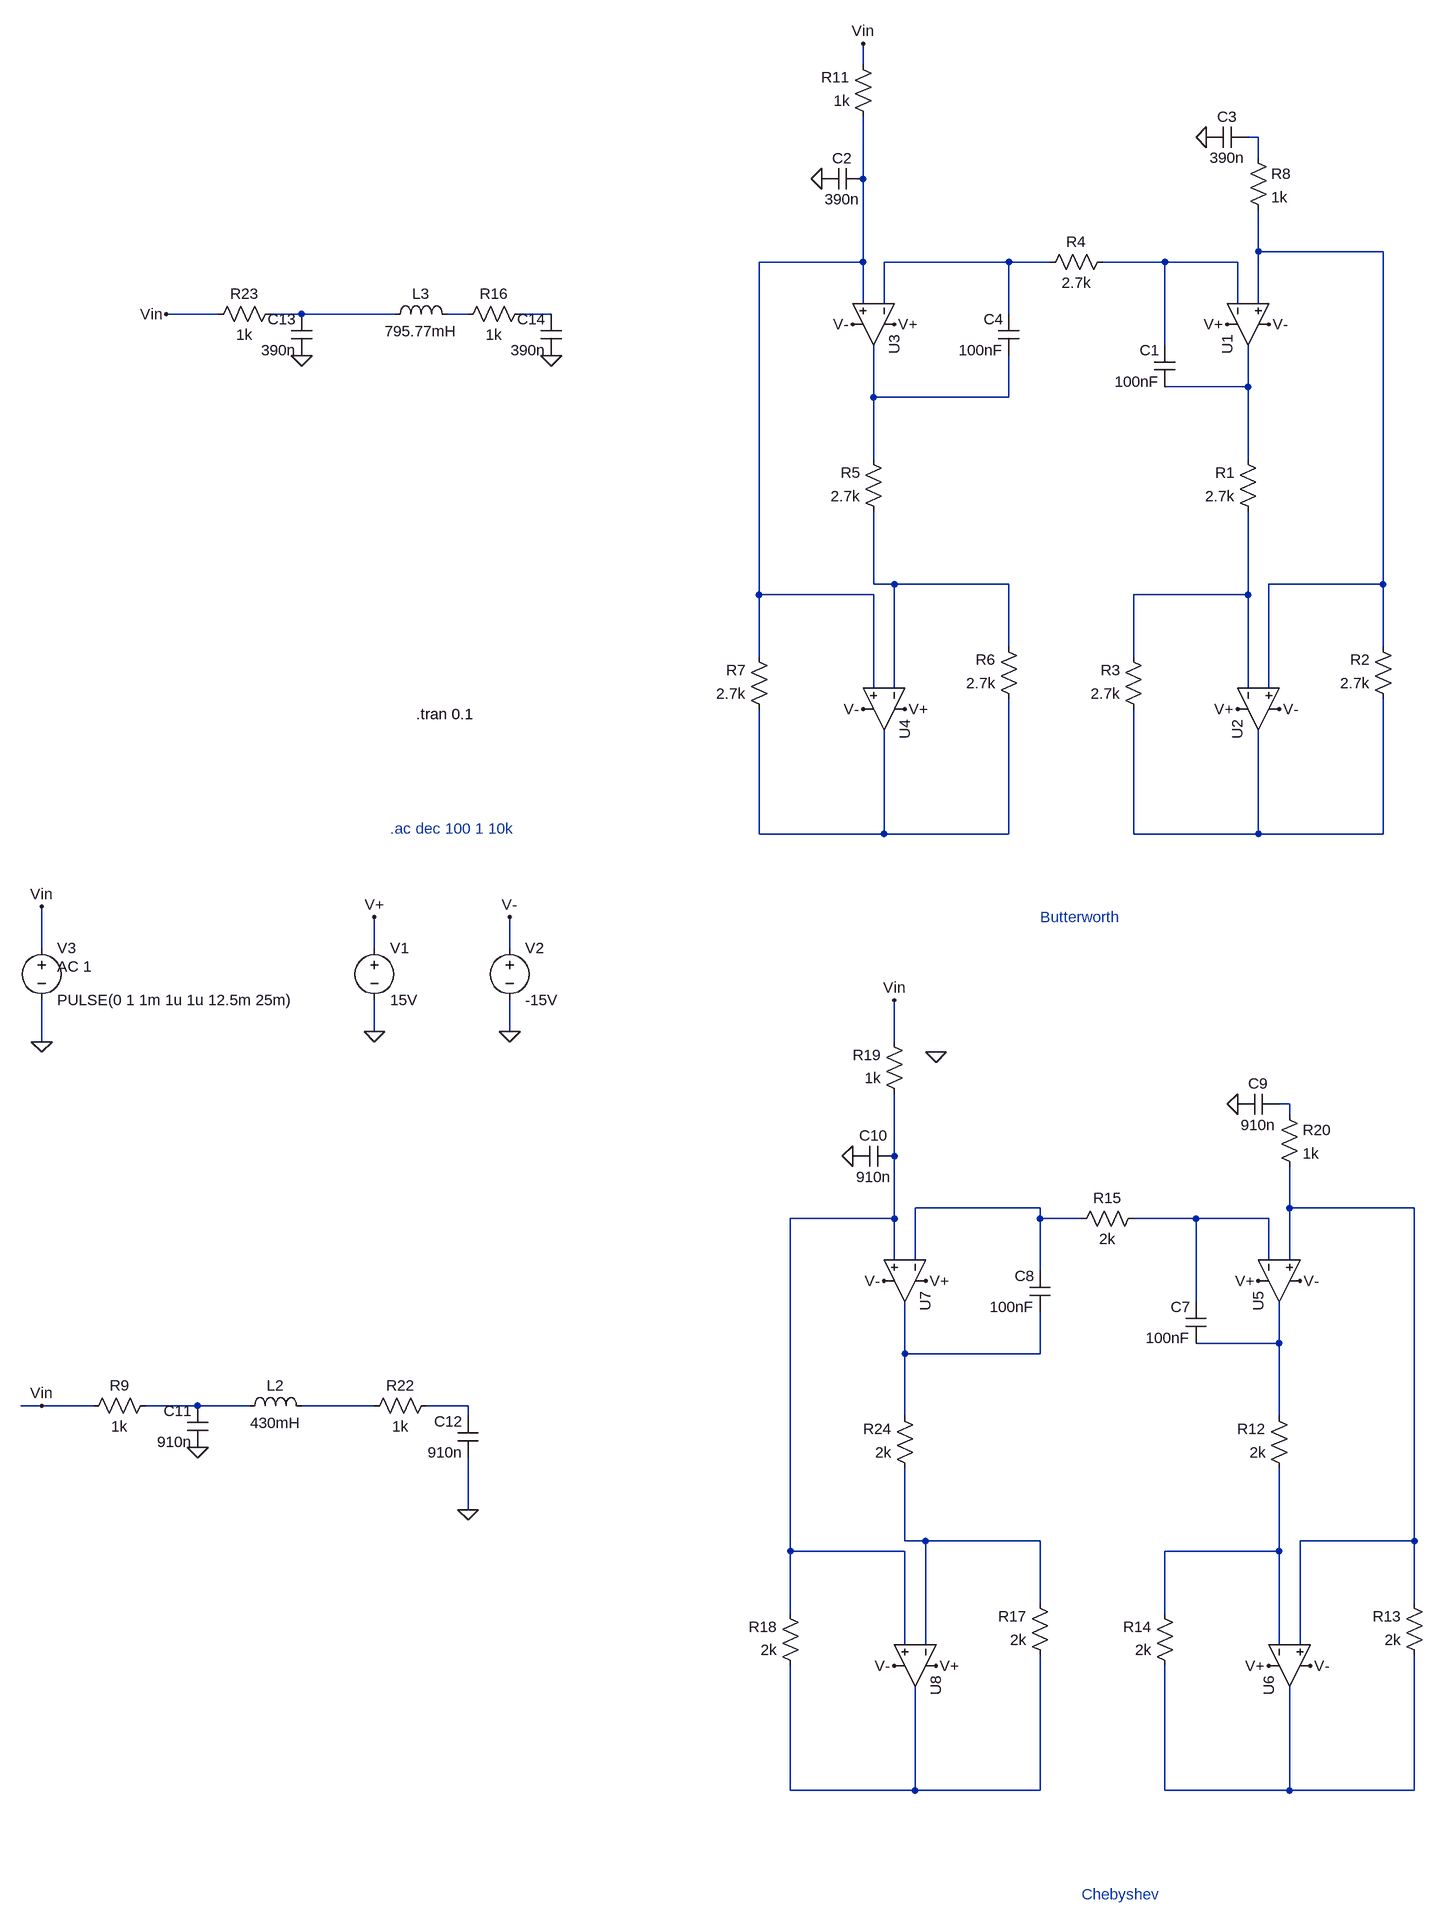
[diagram p0: schematic comparatie-impedanta_practic.asc]
comparatie-impedanta_practic.asc, the LTspice schematic file:
Version 4.1
SHEET 1 3940 2608
WIRE 528 -1200 528 -1232
WIRE 1136 -1088 1120 -1088
WIRE 1136 -1056 1136 -1088
WIRE 528 -1024 528 -1120
WIRE 1136 -912 1136 -976
WIRE 1328 -912 1136 -912
WIRE 528 -896 528 -1024
WIRE 528 -896 368 -896
WIRE 752 -896 560 -896
WIRE 816 -896 752 -896
WIRE 992 -896 896 -896
WIRE 1104 -896 992 -896
WIRE 528 -832 528 -896
WIRE 560 -832 560 -896
WIRE 1104 -832 1104 -896
WIRE 1136 -832 1136 -912
WIRE -464 -816 -544 -816
WIRE -336 -816 -384 -816
WIRE -192 -816 -336 -816
WIRE -80 -816 -112 -816
WIRE 48 -816 0 -816
WIRE 752 -816 752 -896
WIRE 992 -768 992 -896
WIRE 1120 -704 1120 -768
WIRE 1120 -704 992 -704
WIRE 544 -688 544 -768
WIRE 752 -688 752 -752
WIRE 752 -688 544 -688
WIRE 544 -592 544 -688
WIRE 1120 -592 1120 -704
WIRE 544 -400 544 -512
WIRE 576 -400 544 -400
WIRE 752 -400 576 -400
WIRE 1328 -400 1328 -912
WIRE 1328 -400 1152 -400
WIRE 368 -384 368 -896
WIRE 544 -384 368 -384
WIRE 1120 -384 1120 -512
WIRE 1120 -384 944 -384
WIRE 752 -304 752 -400
WIRE 1328 -304 1328 -400
WIRE 368 -288 368 -384
WIRE 944 -288 944 -384
WIRE 544 -240 544 -384
WIRE 576 -240 576 -400
WIRE 1120 -240 1120 -384
WIRE 1152 -240 1152 -400
WIRE 368 -16 368 -208
WIRE 560 -16 560 -176
WIRE 560 -16 368 -16
WIRE 752 -16 752 -224
WIRE 752 -16 560 -16
WIRE 944 -16 944 -208
WIRE 1136 -16 1136 -176
WIRE 1136 -16 944 -16
WIRE 1328 -16 1328 -224
WIRE 1328 -16 1136 -16
WIRE -736 160 -736 96
WIRE -224 160 -224 112
WIRE -16 160 -16 112
WIRE -224 288 -224 240
WIRE -16 288 -16 240
WIRE -736 304 -736 240
WIRE 576 304 576 240
WIRE 1184 400 1168 400
WIRE 1184 416 1184 400
WIRE 576 480 576 384
WIRE 800 560 608 560
WIRE 1184 560 1184 496
WIRE 1376 560 1184 560
WIRE 576 576 576 480
WIRE 576 576 416 576
WIRE 800 576 800 560
WIRE 864 576 800 576
WIRE 1040 576 944 576
WIRE 1152 576 1040 576
WIRE 576 640 576 576
WIRE 608 640 608 560
WIRE 1152 640 1152 576
WIRE 1184 640 1184 560
WIRE 800 656 800 576
WIRE 1040 704 1040 576
WIRE 1168 768 1168 704
WIRE 1168 768 1040 768
WIRE 592 784 592 704
WIRE 800 784 800 720
WIRE 800 784 592 784
WIRE -736 864 -768 864
WIRE -656 864 -736 864
WIRE -496 864 -576 864
WIRE -416 864 -496 864
WIRE -224 864 -336 864
WIRE -80 864 -144 864
WIRE -80 880 -80 864
WIRE 592 880 592 784
WIRE 1168 880 1168 768
WIRE -80 1024 -80 944
WIRE 592 1072 592 960
WIRE 624 1072 592 1072
WIRE 800 1072 624 1072
WIRE 1376 1072 1376 560
WIRE 1376 1072 1200 1072
WIRE 416 1088 416 576
WIRE 592 1088 416 1088
WIRE 1168 1088 1168 960
WIRE 1168 1088 992 1088
WIRE 800 1168 800 1072
WIRE 1376 1168 1376 1072
WIRE 416 1184 416 1088
WIRE 992 1184 992 1088
WIRE 592 1232 592 1088
WIRE 624 1232 624 1072
WIRE 1168 1232 1168 1088
WIRE 1200 1232 1200 1072
WIRE 416 1456 416 1264
WIRE 608 1456 608 1296
WIRE 608 1456 416 1456
WIRE 800 1456 800 1248
WIRE 800 1456 608 1456
WIRE 992 1456 992 1264
WIRE 1184 1456 1184 1296
WIRE 1184 1456 992 1456
WIRE 1376 1456 1376 1248
WIRE 1376 1456 1184 1456
FLAG -224 288 0
FLAG -16 288 0
FLAG -224 112 V+
FLAG -16 112 V-
FLAG 1104 -208 V+
FLAG 1088 -800 V+
FLAG 1168 -208 V-
FLAG 1152 -800 V-
FLAG 592 -208 V+
FLAG 576 -800 V+
FLAG 528 -208 V-
FLAG 512 -800 V-
FLAG 528 -1232 Vin
FLAG -736 304 0
FLAG -736 96 Vin
FLAG 1152 1264 V+
FLAG 1136 672 V+
FLAG 1216 1264 V-
FLAG 1200 672 V-
FLAG 640 1264 V+
FLAG 624 672 V+
FLAG 576 1264 V-
FLAG 560 672 V-
FLAG 640 320 0
FLAG 512 480 0
FLAG 576 240 Vin
FLAG -80 1024 0
FLAG -496 928 0
FLAG -736 864 Vin
FLAG 464 -1024 0
FLAG 1056 -1088 0
FLAG -336 -752 0
FLAG 48 -752 0
FLAG -544 -816 Vin
FLAG 1104 400 0
SYMBOL voltage -224 144 R0
WINDOW 123 0 0 Left 0
WINDOW 39 0 0 Left 0
SYMATTR InstName V1
SYMATTR Value 15V
SYMBOL voltage -16 144 R0
WINDOW 123 0 0 Left 0
WINDOW 39 0 0 Left 0
SYMATTR InstName V2
SYMATTR Value -15V
SYMBOL res 1136 -496 R180
WINDOW 0 36 76 Left 2
WINDOW 3 36 40 Left 2
SYMATTR InstName R1
SYMATTR Value 2.7k
SYMBOL res 1344 -208 R180
WINDOW 0 36 76 Left 2
WINDOW 3 36 40 Left 2
SYMATTR InstName R2
SYMATTR Value 2.7k
SYMBOL res 960 -192 R180
WINDOW 0 36 76 Left 2
WINDOW 3 36 40 Left 2
SYMATTR InstName R3
SYMATTR Value 2.7k
SYMBOL res 912 -912 R90
WINDOW 0 0 56 VBottom 2
WINDOW 3 32 56 VTop 2
SYMATTR InstName R4
SYMATTR Value 2.7k
SYMBOL cap 1008 -704 R180
WINDOW 0 24 56 Left 2
WINDOW 3 24 8 Left 2
SYMATTR InstName C1
SYMATTR Value 100nF
SYMBOL OpAmps\\UniversalOpAmp2 1120 -800 M90
SYMATTR InstName U1
SYMBOL OpAmps\\UniversalOpAmp2 1136 -208 M90
SYMATTR InstName U2
SYMBOL res 560 -496 R180
WINDOW 0 36 76 Left 2
WINDOW 3 36 40 Left 2
SYMATTR InstName R5
SYMATTR Value 2.7k
SYMBOL res 768 -208 R180
WINDOW 0 36 76 Left 2
WINDOW 3 36 40 Left 2
SYMATTR InstName R6
SYMATTR Value 2.7k
SYMBOL res 384 -192 R180
WINDOW 0 36 76 Left 2
WINDOW 3 36 40 Left 2
SYMATTR InstName R7
SYMATTR Value 2.7k
SYMBOL cap 768 -752 R180
WINDOW 0 24 56 Left 2
WINDOW 3 24 8 Left 2
SYMATTR InstName C4
SYMATTR Value 100nF
SYMBOL OpAmps\\UniversalOpAmp2 544 -800 R90
SYMATTR InstName U3
SYMBOL OpAmps\\UniversalOpAmp2 560 -208 R90
SYMATTR InstName U4
SYMBOL voltage -736 144 R0
WINDOW 123 24 44 Left 2
WINDOW 39 0 0 Left 0
SYMATTR Value2 AC 1
SYMATTR InstName V3
SYMATTR Value PULSE(0 1 1m 1u 1u 12.5m 25m)
SYMBOL res 1184 976 R180
WINDOW 0 36 76 Left 2
WINDOW 3 36 40 Left 2
SYMATTR InstName R12
SYMATTR Value 2k
SYMBOL res 1392 1264 R180
WINDOW 0 36 76 Left 2
WINDOW 3 36 40 Left 2
SYMATTR InstName R13
SYMATTR Value 2k
SYMBOL res 1008 1280 R180
WINDOW 0 36 76 Left 2
WINDOW 3 36 40 Left 2
SYMATTR InstName R14
SYMATTR Value 2k
SYMBOL res 960 560 R90
WINDOW 0 0 56 VBottom 2
WINDOW 3 32 56 VTop 2
SYMATTR InstName R15
SYMATTR Value 2k
SYMBOL cap 1056 768 R180
WINDOW 0 24 56 Left 2
WINDOW 3 24 8 Left 2
SYMATTR InstName C7
SYMATTR Value 100nF
SYMBOL OpAmps\\UniversalOpAmp2 1168 672 M90
SYMATTR InstName U5
SYMBOL OpAmps\\UniversalOpAmp2 1184 1264 M90
SYMATTR InstName U6
SYMBOL res 608 976 R180
WINDOW 0 36 76 Left 2
WINDOW 3 36 40 Left 2
SYMATTR InstName R24
SYMATTR Value 2k
SYMBOL res 816 1264 R180
WINDOW 0 36 76 Left 2
WINDOW 3 36 40 Left 2
SYMATTR InstName R17
SYMATTR Value 2k
SYMBOL res 432 1280 R180
WINDOW 0 36 76 Left 2
WINDOW 3 36 40 Left 2
SYMATTR InstName R18
SYMATTR Value 2k
SYMBOL cap 816 720 R180
WINDOW 0 24 56 Left 2
WINDOW 3 24 8 Left 2
SYMATTR InstName C8
SYMATTR Value 100nF
SYMBOL OpAmps\\UniversalOpAmp2 592 672 R90
SYMATTR InstName U7
SYMBOL OpAmps\\UniversalOpAmp2 608 1264 R90
SYMATTR InstName U8
SYMBOL res 592 400 R180
WINDOW 0 36 76 Left 2
WINDOW 3 36 40 Left 2
SYMATTR InstName R19
SYMATTR Value 1k
SYMBOL cap 1168 384 R90
WINDOW 0 0 32 VBottom 2
WINDOW 3 32 32 VTop 2
SYMATTR InstName C9
SYMATTR Value 910n
SYMBOL cap 576 464 R90
WINDOW 0 0 32 VBottom 2
WINDOW 3 32 32 VTop 2
SYMATTR InstName C10
SYMATTR Value 910n
SYMBOL res 1168 400 R0
SYMATTR InstName R20
SYMATTR Value 1k
SYMBOL ind -432 880 R270
WINDOW 0 32 56 VTop 2
WINDOW 3 5 56 VBottom 2
SYMATTR InstName L2
SYMATTR Value 430mH
SYMBOL cap -480 928 R180
WINDOW 0 24 56 Left 2
WINDOW 3 24 8 Left 2
SYMATTR InstName C11
SYMATTR Value 910n
SYMBOL cap -64 944 R180
WINDOW 0 24 56 Left 2
WINDOW 3 24 8 Left 2
SYMATTR InstName C12
SYMATTR Value 910n
SYMBOL res -128 848 R90
WINDOW 0 0 56 VBottom 2
WINDOW 3 32 56 VTop 2
SYMATTR InstName R22
SYMATTR Value 1k
SYMBOL res 1120 -1072 R0
SYMATTR InstName R8
SYMATTR Value 1k
SYMBOL res 544 -1104 R180
WINDOW 0 36 76 Left 2
WINDOW 3 36 40 Left 2
SYMATTR InstName R11
SYMATTR Value 1k
SYMBOL cap 528 -1040 R90
WINDOW 0 0 32 VBottom 2
WINDOW 3 32 32 VTop 2
SYMATTR InstName C2
SYMATTR Value 390n
SYMBOL cap 1120 -1104 R90
WINDOW 0 0 32 VBottom 2
WINDOW 3 32 32 VTop 2
SYMATTR InstName C3
SYMATTR Value 390n
SYMBOL ind -208 -800 R270
WINDOW 0 32 56 VTop 2
WINDOW 3 5 56 VBottom 2
SYMATTR InstName L3
SYMATTR Value 795.77mH
SYMBOL res 16 -832 R90
WINDOW 0 0 56 VBottom 2
WINDOW 3 32 56 VTop 2
SYMATTR InstName R16
SYMATTR Value 1k
SYMBOL res -368 -832 R90
WINDOW 0 0 56 VBottom 2
WINDOW 3 32 56 VTop 2
SYMATTR InstName R23
SYMATTR Value 1k
SYMBOL cap -320 -752 R180
WINDOW 0 24 56 Left 2
WINDOW 3 24 8 Left 2
SYMATTR InstName C13
SYMATTR Value 390n
SYMBOL cap 64 -752 R180
WINDOW 0 24 56 Left 2
WINDOW 3 24 8 Left 2
SYMATTR InstName C14
SYMATTR Value 390n
SYMBOL res -560 848 R90
WINDOW 0 0 56 VBottom 2
WINDOW 3 32 56 VTop 2
SYMATTR InstName R9
SYMATTR Value 1k
TEXT -200 -24 Left 2 ;.ac dec 100 1 10k
TEXT 800 112 Left 2 ;Butterworth
TEXT 864 1616 Left 2 ;Chebyshev
TEXT -160 -200 Left 2 !.tran 0.1

The netlist it stands for:
* comparatie-impedanta_practic.asc
V1 V+ 0 15V
V2 V- 0 -15V
R1 N012 N009 2.7k
R2 N014 N003 2.7k
R3 N014 N012 2.7k
R4 N005 N004 2.7k
C1 N009 N005 100nF
X§U1 N003 N005 V+ V- N009 level2 Avol=1Meg GBW=10Meg Slew=10Meg Ilimit=25m Rail=0 Vos=0 En=0 Enk=0 In=0 Ink=0 Rin=500Meg  ; pins In+ In- V+ V- OUT
X§U2 N003 N012 V+ V- N014 level2 Avol=1Meg GBW=10Meg Slew=10Meg Ilimit=25m Rail=0 Vos=0 En=0 Enk=0 In=0 Ink=0 Rin=500Meg  ; pins In+ In- V+ V- OUT
R5 N011 N010 2.7k
R6 N013 N011 2.7k
R7 N013 N002 2.7k
C4 N010 N004 100nF
X§U3 N002 N004 V+ V- N010 level2 Avol=1Meg GBW=10Meg Slew=10Meg Ilimit=25m Rail=0 Vos=0 En=0 Enk=0 In=0 Ink=0 Rin=500Meg  ; pins In+ In- V+ V- OUT
X§U4 N002 N011 V+ V- N013 level2 Avol=1Meg GBW=10Meg Slew=10Meg Ilimit=25m Rail=0 Vos=0 En=0 Enk=0 In=0 Ink=0 Rin=500Meg  ; pins In+ In- V+ V- OUT
V3 Vin 0 PULSE(0 1 1m 1u 1u 12.5m 25m) AC 1
R12 N026 N020 2k
R13 N028 N018 2k
R14 N028 N026 2k
R15 N019 N017 2k
C7 N020 N019 100nF
X§U5 N018 N019 V+ V- N020 level2 Avol=1Meg GBW=10Meg Slew=10Meg Ilimit=25m Rail=0 Vos=0 En=0 Enk=0 In=0 Ink=0 Rin=500Meg  ; pins In+ In- V+ V- OUT
X§U6 N018 N026 V+ V- N028 level2 Avol=1Meg GBW=10Meg Slew=10Meg Ilimit=25m Rail=0 Vos=0 En=0 Enk=0 In=0 Ink=0 Rin=500Meg  ; pins In+ In- V+ V- OUT
R24 N025 N021 2k
R17 N027 N025 2k
R18 N027 N016 2k
C8 N021 N017 100nF
X§U7 N016 N017 V+ V- N021 level2 Avol=1Meg GBW=10Meg Slew=10Meg Ilimit=25m Rail=0 Vos=0 En=0 Enk=0 In=0 Ink=0 Rin=500Meg  ; pins In+ In- V+ V- OUT
X§U8 N016 N025 V+ V- N027 level2 Avol=1Meg GBW=10Meg Slew=10Meg Ilimit=25m Rail=0 Vos=0 En=0 Enk=0 In=0 Ink=0 Rin=500Meg  ; pins In+ In- V+ V- OUT
R19 N016 Vin 1k
C9 N015 0 910n
C10 N016 0 910n
R20 N015 N018 1k
L2 N022 N023 430mH
C11 0 N022 910n
C12 0 N024 910n
R22 N024 N023 1k
R8 N001 N003 1k
R11 N002 Vin 1k
C2 N002 0 390n
C3 N001 0 390n
L3 N006 N007 795.77mH
R16 N008 N007 1k
R23 N006 Vin 1k
C13 0 N006 390n
C14 0 N008 390n
R9 N022 Vin 1k
* .ac dec 100 1 10k
* Butterworth
* Chebyshev
.tran 0.1
.lib UniversalOpAmp2.lib
.backanno
.end